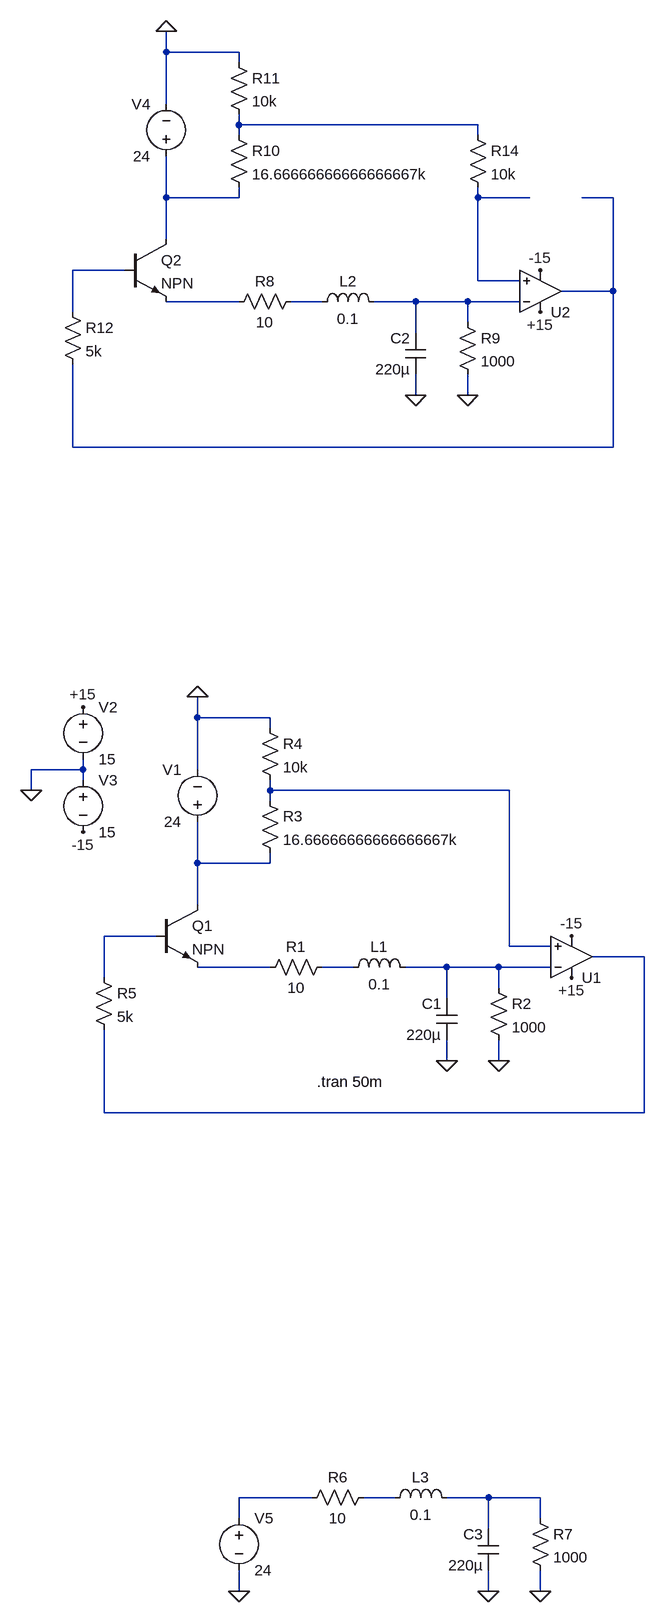
[diagram p0: schematic taller3.asc]
taller3.asc, the LTspice schematic file:
Version 4.1
SHEET 1 2128 1060
WIRE 32 -1328 32 -1360
WIRE 144 -1328 32 -1328
WIRE 144 -1312 144 -1328
WIRE 32 -1248 32 -1328
WIRE 144 -1216 144 -1232
WIRE 512 -1216 144 -1216
WIRE 144 -1200 144 -1216
WIRE 512 -1200 512 -1216
WIRE 32 -1104 32 -1168
WIRE 144 -1104 144 -1120
WIRE 144 -1104 32 -1104
WIRE 512 -1104 512 -1120
WIRE 592 -1104 512 -1104
WIRE 720 -1104 672 -1104
WIRE 32 -1040 32 -1104
WIRE -32 -992 -112 -992
WIRE 512 -976 512 -1104
WIRE 576 -976 512 -976
WIRE 720 -960 720 -1104
WIRE 720 -960 640 -960
WIRE 144 -944 32 -944
WIRE 272 -944 224 -944
WIRE 416 -944 352 -944
WIRE 496 -944 416 -944
WIRE 576 -944 496 -944
WIRE -112 -928 -112 -992
WIRE 496 -912 496 -944
WIRE 416 -896 416 -944
WIRE 416 -800 416 -832
WIRE 496 -800 496 -832
WIRE -112 -720 -112 -848
WIRE 720 -720 720 -960
WIRE 720 -720 -112 -720
WIRE 80 -304 80 -336
WIRE 192 -304 80 -304
WIRE 192 -288 192 -304
WIRE -96 -224 -96 -240
WIRE -96 -224 -176 -224
WIRE 80 -224 80 -304
WIRE -96 -208 -96 -224
WIRE -176 -192 -176 -224
WIRE 192 -192 192 -208
WIRE 560 -192 192 -192
WIRE 192 -176 192 -192
WIRE 80 -80 80 -144
WIRE 192 -80 192 -96
WIRE 192 -80 80 -80
WIRE 80 -16 80 -80
WIRE 16 32 -64 32
WIRE 560 48 560 -192
WIRE 624 48 560 48
WIRE 768 64 688 64
WIRE 192 80 80 80
WIRE 320 80 272 80
WIRE 464 80 400 80
WIRE 544 80 464 80
WIRE 624 80 544 80
WIRE -64 96 -64 32
WIRE 544 112 544 80
WIRE 464 128 464 80
WIRE 464 224 464 192
WIRE 544 224 544 192
WIRE -64 304 -64 176
WIRE 768 304 768 64
WIRE 768 304 -64 304
WIRE 256 896 144 896
WIRE 384 896 336 896
WIRE 528 896 464 896
WIRE 608 896 528 896
WIRE 144 928 144 896
WIRE 608 928 608 896
WIRE 528 944 528 896
WIRE 144 1040 144 1008
WIRE 528 1040 528 1008
WIRE 608 1040 608 1008
FLAG 80 -336 0
FLAG 464 224 0
FLAG -176 -192 0
FLAG -96 -320 +15
FLAG -96 -128 -15
FLAG 544 224 0
FLAG 656 32 -15
FLAG 656 96 +15
FLAG 32 -1360 0
FLAG 416 -800 0
FLAG 496 -800 0
FLAG 608 -992 -15
FLAG 608 -928 +15
FLAG 144 1040 0
FLAG 528 1040 0
FLAG 608 1040 0
SYMBOL voltage 80 -128 R180
WINDOW 0 24 96 Left 2
WINDOW 3 24 16 Left 2
SYMATTR InstName V1
SYMATTR Value 24
SYMBOL res 288 64 R90
WINDOW 0 0 56 VBottom 2
WINDOW 3 32 56 VTop 2
SYMATTR InstName R1
SYMATTR Value 10
SYMBOL cap 480 192 R180
WINDOW 0 24 56 Left 2
WINDOW 3 24 8 Left 2
SYMATTR InstName C1
SYMATTR Value 220µ
SYMBOL ind 304 96 R270
WINDOW 0 32 56 VTop 2
WINDOW 3 5 56 VBottom 2
SYMATTR InstName L1
SYMATTR Value 0.1
SYMBOL voltage -96 -336 R0
SYMATTR InstName V2
SYMATTR Value 15
SYMBOL voltage -96 -224 R0
SYMATTR InstName V3
SYMATTR Value 15
SYMBOL npn 16 -16 R0
SYMATTR InstName Q1
SYMBOL res 528 96 R0
SYMATTR InstName R2
SYMATTR Value 1000
SYMBOL res 176 -192 R0
SYMATTR InstName R3
SYMATTR Value 16.66666666666666667k
SYMBOL res 176 -304 R0
SYMATTR InstName R4
SYMATTR Value 10k
SYMBOL OpAmps\\UniversalOpAmp2 656 64 M180
SYMATTR InstName U1
SYMBOL res -80 80 R0
SYMATTR InstName R5
SYMATTR Value 5k
SYMBOL voltage 32 -1152 R180
WINDOW 0 24 96 Left 2
WINDOW 3 24 16 Left 2
SYMATTR InstName V4
SYMATTR Value 24
SYMBOL res 240 -960 R90
WINDOW 0 0 56 VBottom 2
WINDOW 3 32 56 VTop 2
SYMATTR InstName R8
SYMATTR Value 10
SYMBOL cap 432 -832 R180
WINDOW 0 24 56 Left 2
WINDOW 3 24 8 Left 2
SYMATTR InstName C2
SYMATTR Value 220µ
SYMBOL ind 256 -928 R270
WINDOW 0 32 56 VTop 2
WINDOW 3 5 56 VBottom 2
SYMATTR InstName L2
SYMATTR Value 0.1
SYMBOL npn -32 -1040 R0
SYMATTR InstName Q2
SYMBOL res 480 -928 R0
SYMATTR InstName R9
SYMATTR Value 1000
SYMBOL res 128 -1216 R0
SYMATTR InstName R10
SYMATTR Value 16.66666666666666667k
SYMBOL res 128 -1328 R0
SYMATTR InstName R11
SYMATTR Value 10k
SYMBOL OpAmps\\UniversalOpAmp2 608 -960 M180
SYMATTR InstName U2
SYMBOL res -128 -944 R0
SYMATTR InstName R12
SYMATTR Value 5k
SYMBOL res 496 -1216 R0
SYMATTR InstName R14
SYMATTR Value 10k
SYMBOL voltage 144 912 R0
SYMATTR InstName V5
SYMATTR Value 24
SYMBOL res 352 880 R90
WINDOW 0 0 56 VBottom 2
WINDOW 3 32 56 VTop 2
SYMATTR InstName R6
SYMATTR Value 10
SYMBOL cap 544 1008 R180
WINDOW 0 24 56 Left 2
WINDOW 3 24 8 Left 2
SYMATTR InstName C3
SYMATTR Value 220µ
SYMBOL ind 368 912 R270
WINDOW 0 32 56 VTop 2
WINDOW 3 5 56 VBottom 2
SYMATTR InstName L3
SYMATTR Value 0.1
SYMBOL res 592 912 R0
SYMATTR InstName R7
SYMATTR Value 1000
TEXT 264 256 Left 2 !.tran 50m

The netlist it stands for:
* taller3.asc
V1 N010 0 24
R1 N014 N013 10
C1 0 N015 220µ
L1 N014 N015 0.1
V2 +15 0 15
V3 0 -15 15
Q1 N010 N011 N013 0 NPN
R2 N015 0 1000
R3 N009 N010 16.66666666666666667k
R4 0 N009 10k
X§U1 N009 N015 +15 -15 N012 level2 Avol=1Meg GBW=10Meg Slew=10Meg Ilimit=25m Rail=0 Vos=0 En=0 Enk=0 In=0 Ink=0 Rin=500Meg  ; pins In+ In- V+ V- OUT
R5 N011 N012 5k
V4 N002 0 24
R8 N007 N006 10
C2 0 N008 220µ
L2 N007 N008 0.1
Q2 N002 N005 N006 0 NPN
R9 N008 0 1000
R10 N001 N002 16.66666666666666667k
R11 0 N001 10k
X§U2 N003 N008 +15 -15 N004 level2 Avol=1Meg GBW=10Meg Slew=10Meg Ilimit=25m Rail=0 Vos=0 En=0 Enk=0 In=0 Ink=0 Rin=500Meg  ; pins In+ In- V+ V- OUT
R12 N005 N004 5k
R14 N001 N003 10k
V5 N016 0 24
R6 N017 N016 10
C3 0 N018 220µ
L3 N017 N018 0.1
R7 N018 0 1000
.model NPN NPN
.model PNP PNP
.lib standard.bjt
.tran 50m
.lib UniversalOpAmp2.lib
.backanno
.end